# Altium schematic sheet Other.SchDoc
size A4; Organization: Altium Limited; Address1: 3 Minna Close; Address2: Belrose; Address3: NSW 2085; Address4: Australia
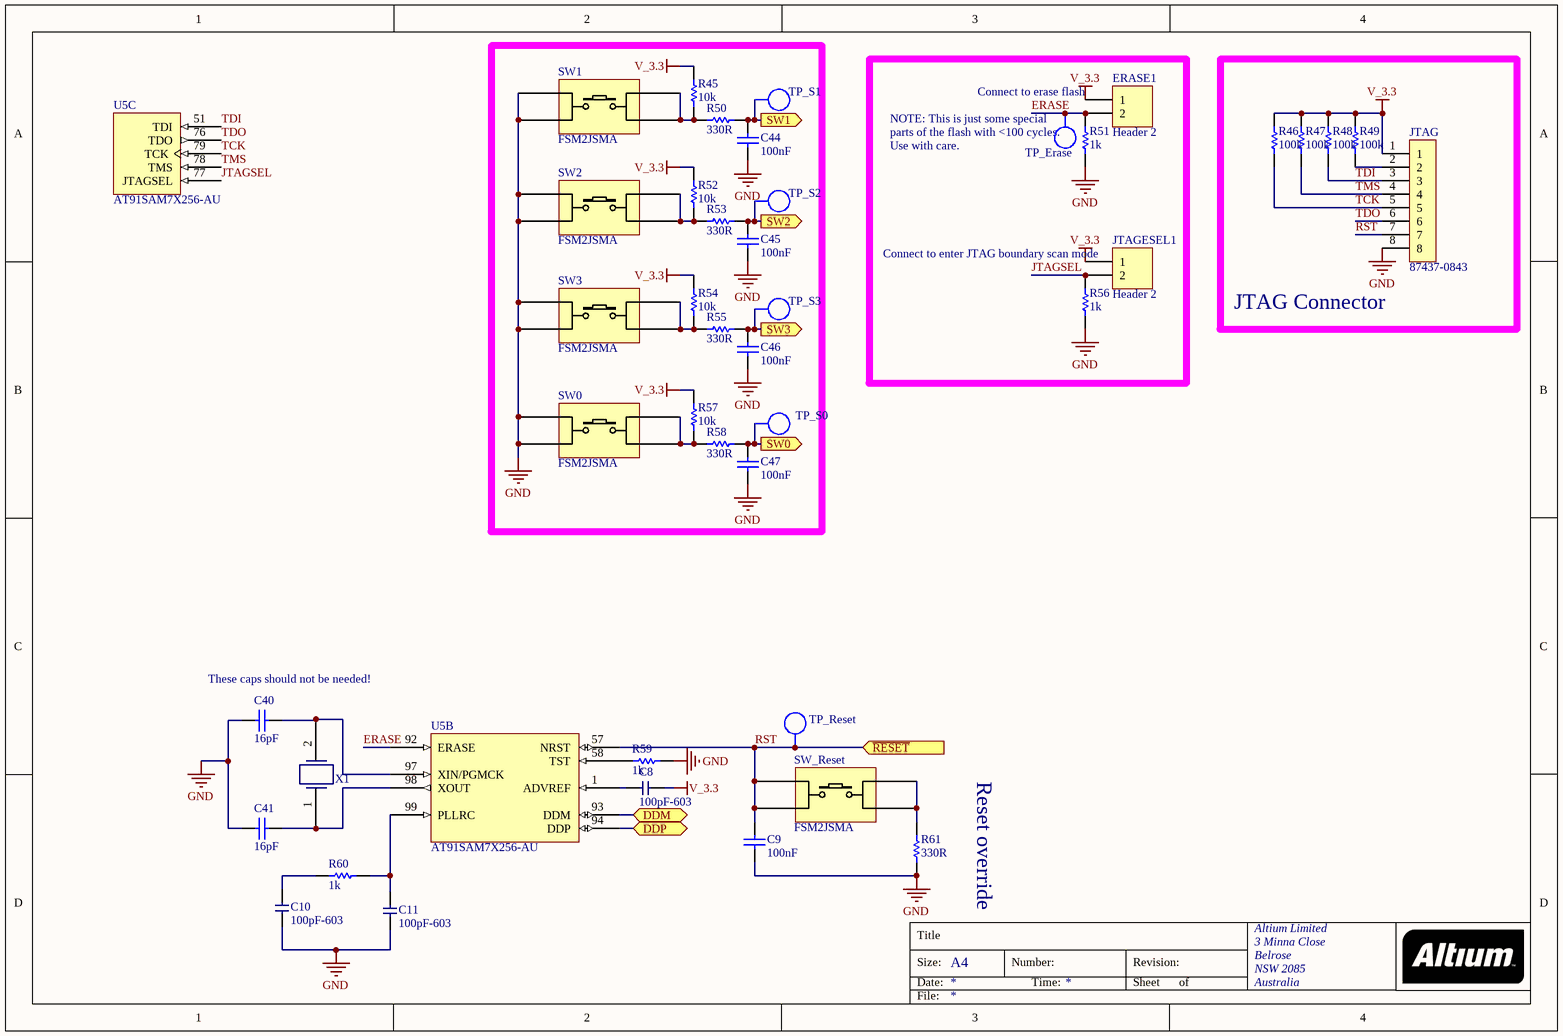
[diagram p0: Other.SchDoc]

## Parts
C8  100pF-603  [0603 Resistor]
C9  100nF  [0603]
C10  100pF-603  [0603 Resistor]
C11  100pF-603  [0603 Resistor]
C40  16pF  [0603]
C41  16pF  [0603]
C44  100nF  [0603]
C45  100nF  [0603]
C46  100nF  [0603]
C47  100nF  [0603]
ERASE1  Header 2  [HDR1X2]
JTAG  87437-0843  [87437-0843]
JTAGESEL1  Header 2  [HDR1X2]
R45  10k  [0603]
R46  100k  [0603]
R47  100k  [0603]
R48  100k  [0603]
R49  100k  [0603]
R50  330R  [0603]
R51  1k  [0603]
R52  10k  [0603]
R53  330R  [0603]
R54  10k  [0603]
R55  330R  [0603]
R56  1k  [0603]
R57  10k  [0603]
R58  330R  [0603]
R59  1k  [0603]
R60  1k  [0603]
R61  330R  [0603]
SW0  FSM2JSMA  [FSM2JSMA]
SW1  FSM2JSMA  [FSM2JSMA]
SW2  FSM2JSMA  [FSM2JSMA]
SW3  FSM2JSMA  [FSM2JSMA]
SW_Reset  FSM2JSMA  [FSM2JSMA]
TP_Erase  TP  [TEST_POINT_4X2MM]  (value not drawn)  (no BOM)
TP_Reset  TP  [TEST_POINT_4X2MM]  (value not drawn)  (no BOM)
TP_S0  TP  [TEST_POINT_4X2MM]  (value not drawn)  (no BOM)
TP_S1  TP  [TEST_POINT_4X2MM]  (value not drawn)  (no BOM)
TP_S2  TP  [TEST_POINT_4X2MM]  (value not drawn)  (no BOM)
TP_S3  TP  [TEST_POINT_4X2MM]  (value not drawn)  (no BOM)
U5  AT91SAM7X256-AU  [LQFP100_N]  (parts B,C of 4)
X1  ECS-184-20-5PXDU-TR  [HC49/US]  (value not drawn)

## Blocks framed on the sheet
JTAG Connector: JTAG R46-R49

## Ports
DDM (bidir), DDP (bidir), SW0 (out), SW1 (out), SW2 (out), SW3 (out), ~{RESET} (in)

## Nets
GND: C9.2 C10.1 C11.1 C40.1 C41.2 C44.1 C45.1 C46.1 C47.1 JTAG.8 R51.1 R56.1 R59.1 R61.1 SW0.1 SW0.2 SW1.1 SW1.2 SW2.1 SW2.2 SW3.1 SW3.2
V_3.3: C8.2 ERASE1.1 JTAG.1 JTAGESEL1.1 R45.2 R46.1 R47.1 R48.1 R49.1 R52.2 R54.2 R57.2
DDM: U5.93(DDM) ; port DDM
DDP: U5.94(DDP) ; port DDP
ERASE: ERASE1.2 R51.2 TP_Erase.1 U5.92(ERASE)
JTAGSEL: JTAGESEL1.2 R56.2 U5.77(JTAGSEL)
RST: C9.1 JTAG.7 SW_Reset.1 SW_Reset.2 TP_Reset.1 U5.57(NRST) ; port ~{RESET}
SW0: C47.2 R58.2 TP_S0.1 ; port SW0
SW1: C44.2 R50.2 TP_S1.1 ; port SW1
SW2: C45.2 R53.2 TP_S2.1 ; port SW2
SW3: C46.2 R55.2 TP_S3.1 ; port SW3
TCK: JTAG.5 R46.2 U5.79(TCK)
TDI: JTAG.3 R48.2 U5.51(TDI)
TDO: JTAG.6 U5.76(TDO)
TMS: JTAG.4 R47.2 U5.78(TMS)
NetC8_1: C8.1 U5.1(ADVREF)
NetC10_2: C10.2 R60.1
NetC11_2: C11.2 R60.2 U5.99(PLLRC)
NetC40_2: C40.2 U5.97(XIN/PGMCK) X1.2
NetC41_1: C41.1 U5.98(XOUT) X1.1
NetJTAG_2: JTAG.2 R49.2
NetR45_1: R45.1 R50.1 SW1.3 SW1.4
NetR52_1: R52.1 R53.1 SW2.3 SW2.4
NetR54_1: R54.1 R55.1 SW3.3 SW3.4
NetR57_1: R57.1 R58.1 SW0.3 SW0.4
NetR59_2: R59.2 U5.58(TST)
NetR61_2: R61.2 SW_Reset.3 SW_Reset.4

## Notes on the sheet
- (near ERASE1) Connect to erase flash
- (near TP_Erase) NOTE: This is just some special
- parts of the flash with <100 cycles.
- Use with care.
- (near JTAGESEL1) Connect to enter JTAG boundary scan mode
- (near C40) These caps should not be needed!
- Reset override
- Title
- Size:
- Date:
- A4
- Number:
- Time:
- Revision:
- Sheet
- of
- File:

## Library data of the parts
C8 C10 C11 = 100pF-603: Manufacturer Part Number: 06035A101JAT2A; Manufacturer: AVX Corporation; Supplier 1: Digi-Key; Supplier Part Number 1: 478-1175-1-ND
C9 C44-C47 = CP_100nF 0603: CAP CER .10UF 50V X5R 0603; Manufacturer: Taiyo Yuden; Manufacturer PN: UMK107B7104KA-T; Value: 100nF; Part Number: CP_100nF 0603; Component Kind: Standard; Component Type: Standard; Designator: CP_100nF 0603; Pin Count: 2; LatestRevisionDate: 29 May 08; Supplier 1: Digi-Key; Supplier Part Number 1: 478-6206-1-ND; Signal Integrity: Cap; Simulation: CAP
C40 C41 = CP_16pF_100V_0603: CAP CER 16PF 100V 5% C0G 0603; Manufacturer: Murata; Manufacturer PN: GRM1885C2A160JA01D; Supplier 1: Digi-Key; Supplier Part Number 1: 490-1332-1-ND; Value: 16pF; Part Number: CP_16pF_100V_0603; Component Kind: Standard; Component Type: Standard; Designator: CP_16pF_100V_0603; Pin Count: 2; Signal Integrity: Cap; Simulation: CAP
ERASE1 JTAGESEL1 = Header 2: Header, 2-Pin; LatestRevisionDate: 17-Jul-2002; LatestRevisionNote: Re-released for DXP Platform.; Publisher: Altium Limited
JTAG = 87437-0843: Manufacturer: Molex; Manufacturer Part Number: 87437-0843; Supplier 1: Digikey; Supplier Part Number 1: WM7667CT-ND
R45 R52 R54 R57 = RS_10k 0603: RES 10.0K OHM 1/10W 1% 0603 SMD; Manufacturer: Yageo; Manufacturer PN: RC0603FR-0710KL; LatestRevisionDate: 29 May 08; Supplier 1: Digi-Key; Supplier Part Number 1: 311-10.0KHRTR-ND; Value: 10k; Part Number: RS_10k 0603; Component Kind: Standard; Component Type: Standard; Designator: RS_10k 0603; Pin Count: 2; Signal Integrity: Res; Simulation: RESISTOR
R46-R49 = RS_100k 0603: RES 100K OHM 1/10W 1% 0603 SMD; Manufacturer: Yageo; Manufacturer PN: RC0603FR-07100KL; Value: 100k; Part Number: RS_100k 0603; Component Kind: Standard; Component Type: Standard; Designator: RS_100k 0603; Pin Count: 2; LatestRevisionDate: 1 Jun 08; Supplier 1: Digi-Key; Supplier Part Number 1: 311-100KHRTR-ND; Signal Integrity: Res; Simulation: RESISTOR
R50 R53 R55 R58 R61 = RS_330R 0603: RES 330 OHM 1/10W 1% 0603 SMD; Manufacturer: Yageo; Manufacturer PN: RC0603FR-07330RL; LatestRevisionDate: 25 June 2009; Supplier 1: Digi-Key; Supplier Part Number 1: 311-330HRTR-ND; Value: 330R; Part Number: RS_330R 0603; Component Kind: Standard; Component Type: Standard; Designator: RS_330R 0603; Pin Count: 2; Signal Integrity: Res; Simulation: RESISTOR
R51 R56 R59 R60 = RS_1k 0603: RES 1.00K OHM 1/10W 1% 0603 SMD; Manufacturer: ROHM; Manufacturer PN: MCR03EZPFX1001; Value: 1k; Part Number: RS_1k 0603; Component Kind: Standard; Component Type: Standard; Designator: RS_1k 0603; Pin Count: 2; LatestRevisionDate: 17-Jul-2002; Supplier 1: Digi-Key; Supplier Part Number 1: RHM1.00KHTR-ND; Signal Integrity: Res; Simulation: RESISTOR
SW0-SW3 SW_Reset = SW_FSM2JSMA: DPST SMD Switch; Manufacturer: Tyco Electronics; Supplier 1: Element 14; Supplier Part Number 1: 3801287; price: 0.516; Supplier 2: Digi-Key; Supplier Part Number 2: 450-1130-ND; value: FSM2JSMA; Part Number: SW_FSM2JSMA; Component Kind: Standard; Component Type: Standard; Designator: SW_FSM2JSMA; Pin Count: 4
TP_Erase TP_Reset TP_S0-TP_S3 = TP_TESTPOINT: Test-Point; LatestRevisionDate: 29 May 08; Manufacturer PN: *; Manufacturer: *; Supplier 1: Digi-Key; Supplier Part Number 1: 5016KTR-ND; Value: TP; Part Number: TP_TESTPOINT; Component Type: Standard (No BOM); Designator: TP_TESTPOINT; Pin Count: 1
U5 = AT91SAM7X256-AU: Smart ARM Microcontroller, ARM7TDMI 32-Bit RISC CPU, 256KB Flash and 64KB SRAM, 100-Pin LQFP, Industrial, Pb-Free; Published: 16-Oct-2006; DatasheetVersion: 17-Oct-2005; PackageVersion: Apr-2006; PackageReference: LQFP100; Publisher: Altium Limited; PackageDescription: 100-Pin Thin Quad Flat Pack 0.5 mm Pitch; Code_JEDEC: MS-026-BED; ComponentLink1Description: Manufacturer Link; ComponentLink1URL: http://www.atmel.com; ComponentLink2Description: Datasheet; ComponentLink2URL: http://www.atmel.com/dyn/resources/prod_documents/6120s.pdf
X1 = ECS-184-20-5PXDU-TR: Manufacturer: ECS Inc; Supplier 1: Digikey; Manufacturer Part Number: ECS-184-20-5PXDU-TR; Supplier Part Number 1: XC1536CT-ND